# EAGLE schematic 4brar07_ESP8266 (EAGLE 9.6.2)
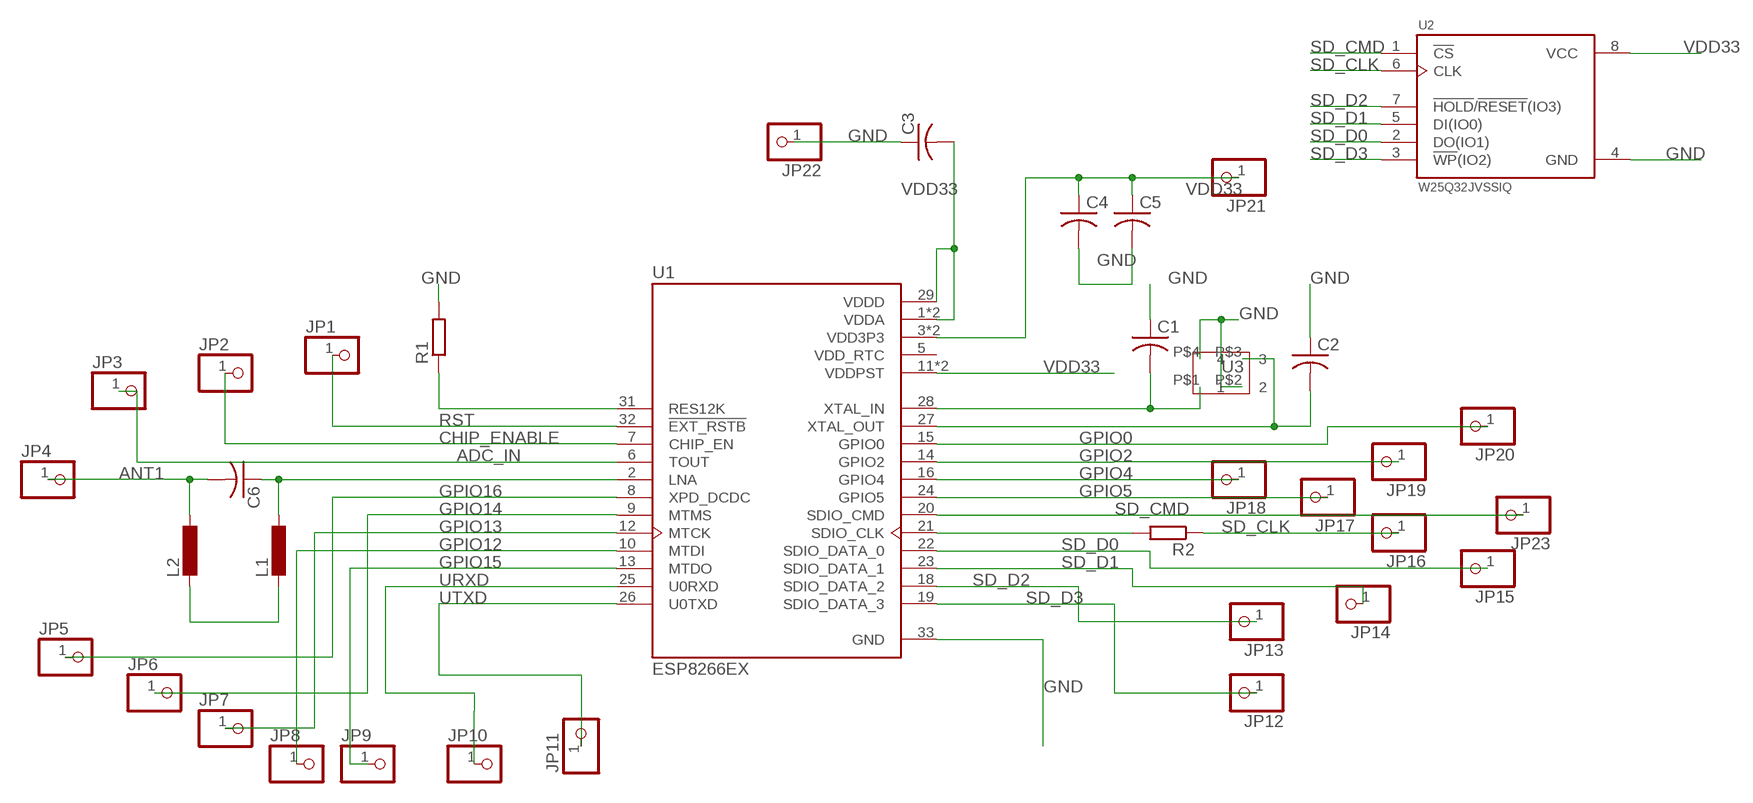
[diagram p0: schematic, sheet 1]

## Parts
C1  C-USC0805  [C0805]
C2  C-USC0805  [C0805]
C3  C-USC0805  [C0805]
C4  C-USC0805  [C0805]
C5  C-USC0805  [C0805]
C6  C-USC0805  [C0805]
JP1  PINHD-1X1  [1X01]
JP2  PINHD-1X1  [1X01]
JP3  PINHD-1X1  [1X01]
JP4  PINHD-1X1  [1X01]
JP5  PINHD-1X1  [1X01]
JP6  PINHD-1X1  [1X01]
JP7  PINHD-1X1  [1X01]
JP8  PINHD-1X1  [1X01]
JP9  PINHD-1X1  [1X01]
JP10  PINHD-1X1  [1X01]
JP11  PINHD-1X1  [1X01]
JP12  PINHD-1X1  [1X01]
JP13  PINHD-1X1  [1X01]
JP14  PINHD-1X1  [1X01]
JP15  PINHD-1X1  [1X01]
JP16  PINHD-1X1  [1X01]
JP17  PINHD-1X1  [1X01]
JP18  PINHD-1X1  [1X01]
JP19  PINHD-1X1  [1X01]
JP20  PINHD-1X1  [1X01]
JP21  PINHD-1X1  [1X01]
JP22  PINHD-1X1  [1X01]
JP23  PINHD-1X1  [1X01]
L1  L-EUL1812  [L1812]
L2  L-EUL1812  [L1812]
R1  R-EU_R0805  [R0805]
R2  R-EU_R0805  [R0805]
U1  ESP8266EX  [QFN50P500X500X80-33N]
U2  W25Q32JVSSIQ  [SOIC127P790X216-8N]
U3  Q22FA12800332  [OSCILLATOR]

## Nets
ADC_IN: JP3.1 U1.6(TOUT)
ANT1 [antenna]: C6.2 JP4.1 L2.1
CHIP_ENABLE: JP2.1 U1.7(CHIP_EN)
GND [power]: C1.1 C2.1 C3.1 C4.2 C5.2 JP22.1 R1.2 U1.33(GND) U2.4(GND) U3.P$2 U3.P$4
GPIO0: JP20.1 U1.15(GPIO0)
GPIO2: JP19.1 U1.14(GPIO2)
GPIO4: JP18.1 U1.16(GPIO4)
GPIO5: JP17.1 U1.24(GPIO5)
GPIO12: JP8.1 U1.10(MTDI)
GPIO13: JP7.1 U1.12(MTCK)
GPIO14: JP6.1 U1.9(MTMS)
GPIO15: JP9.1 U1.13(MTDO)
GPIO16: JP5.1 U1.8(XPD_DCDC)
N$1: C1.2 U1.28(XTAL_IN) U3.P$1
N$2: C2.2 U1.27(XTAL_OUT) U3.P$3
N$7: C6.1 L1.1 U1.2(LNA)
N$21: R1.1 U1.31(RES12K)
N$26: R2.2 U1.21(SDIO_CLK)
N$28: L1.2 L2.2
RST: JP1.1 U1.32(!EXT_RSTB)
SD_CLK: JP16.1 R2.1 U2.6(CLK)
SD_CMD: JP23.1 U1.20(SDIO_CMD) U2.1(!CS)
SD_D0: JP15.1 U1.22(SDIO_DATA_0) U2.2(DO(IO1))
SD_D1: JP14.1 U1.23(SDIO_DATA_1) U2.5(DI(IO0))
SD_D2: JP13.1 U1.18(SDIO_DATA_2) U2.7(!HOLD!/!RESET!(IO3))
SD_D3: JP12.1 U1.19(SDIO_DATA_3) U2.3(!WP!(IO2))
URXD: JP10.1 U1.25(U0RXD)
UTXD: JP11.1 U1.26(U0TXD)
VDD33 [power]: C3.2 C4.1 C5.1 JP21.1 U1.1(VDDA) U1.3(VDD3P3) U1.4(VDD3P3) U1.11(VDDPST) U1.17(VDDPST) U1.29(VDDD) U1.30(VDDA) U2.8(VCC)

## Power pins joined to a net without a drawn wire
VDD_RTC: U1.5(VDD_RTC)

## Library data of the parts
C1-C6 = rcl:C-US: CAPACITOR, American symbol; SPICEPREFIX: C
JP1-JP23 = pinhead:PINHD-1X1: PIN HEADER
L1 L2 = rcl:L-EU: INDUCTOR, European symbol; SPICEPREFIX: L
R1 R2 = rcl:R-EU_: RESISTOR, European symbol; SPICEPREFIX: R
U1 = ESP8266EX:ESP8266EX: Check availability <https://pricing.snapeda.com/parts/ESP8266EX/Espressif%20Systems/view-part?ref=eda>; AVAILABILITY: In Stock; CHECK_PRICES: https://www.snapeda.com/parts/ESP8266EX/Espressif+Systems/view-part/?ref=eda; DESCRIPTION: IC RF TxRx + MCU WiFi 802.11b/g/n 2.4GHz 32-VFQFN Exposed Pad; MF: Espressif Systems; MP: ESP8266EX; PACKAGE: VFQFN-32 Espressif Systems; PRICE: None; SNAPEDA_LINK: https://www.snapeda.com/parts/ESP8266EX/Espressif+Systems/view-part/?ref=snap
U2 = W25Q32JVSSIQ:W25Q32JVSSIQ: Check availability <https://pricing.snapeda.com/parts/W25Q32JVSSIQ/Winbond/view-part?ref=eda>; AVAILABILITY: In Stock; CHECK_PRICES: https://www.snapeda.com/parts/W25Q32JVSSIQ/Winbond/view-part/?ref=eda; DESCRIPTION: FLASH - NOR Memory IC 32Mb (4M x 8) SPI - Quad I/O 133 MHz 8-SOIC; MF: Winbond; MP: W25Q32JVSSIQ; PACKAGE: SOIC-8 Winbond; PRICE: None; SNAPEDA_LINK: https://www.snapeda.com/parts/W25Q32JVSSIQ/Winbond/view-part/?ref=snap
U3 = Q22FA12800332:Q22FA12800332; U3: U3

## Net classes
0 default: width 0.25 mm
1 power: width 0.25 mm
2 antenna: width 0.25 mm